# Altium schematic sheet I2C_Keypad.SchDoc
size B; DocumentNumber: 4; SheetNumber: 4; SheetTotal: 6
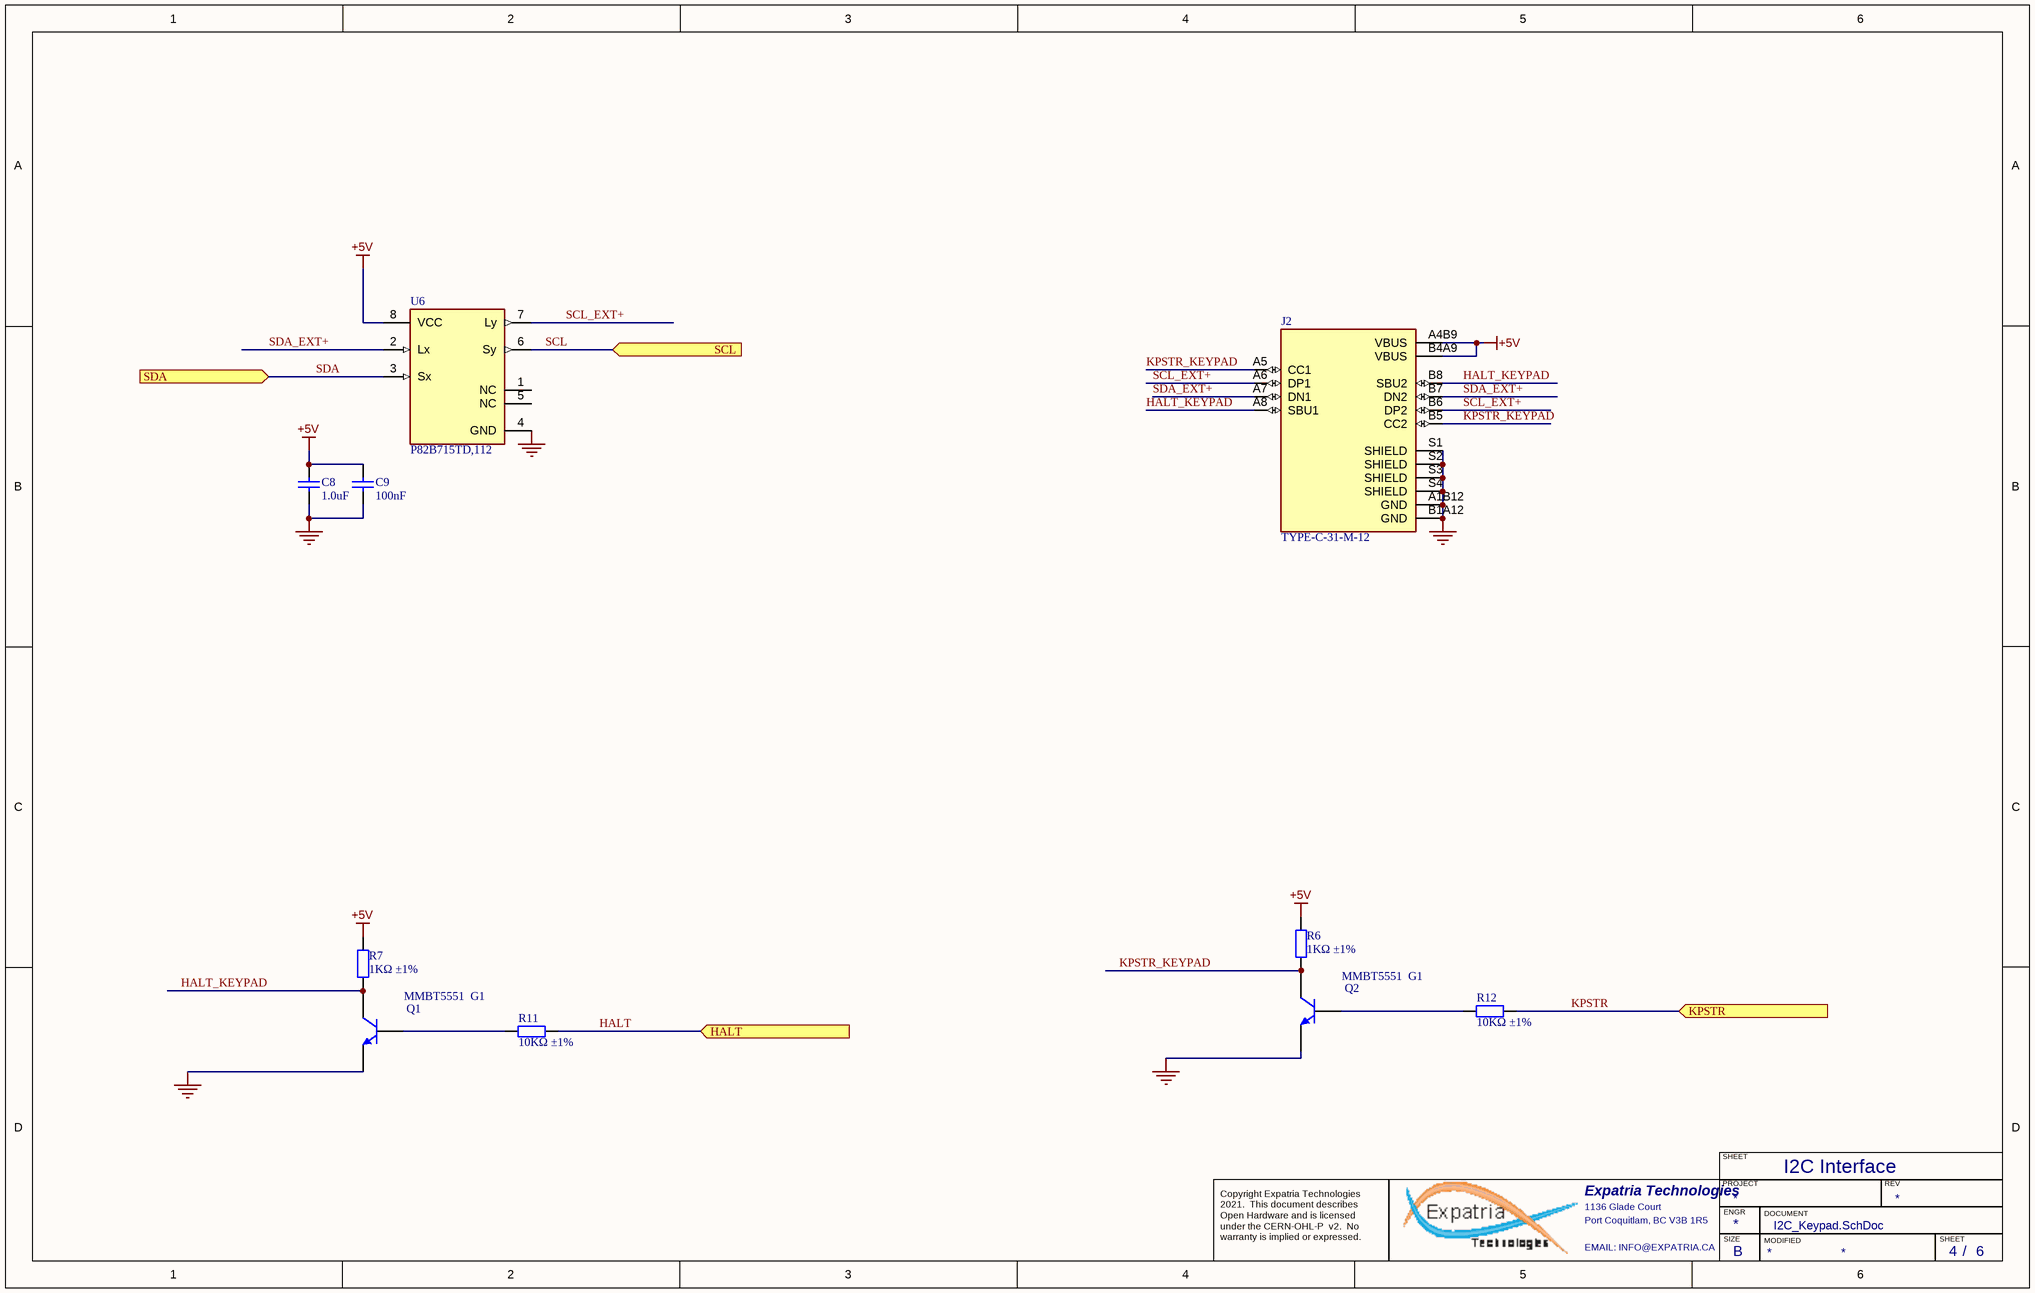
[diagram p0: I2C_Keypad.SchDoc]

## Parts
C8  1.0uF  [0402_C]
C9  100nF  [0402_C]
J2  TYPE-C-31-M-12  [HRO_TYPE-C-31-M-12]
Q1  MMBT5551  G1  [SOT-23(SOT-23-3)]
Q2  MMBT5551  G1  [SOT-23(SOT-23-3)]
R6  1KΩ ±1%  [0402_R]
R7  1KΩ ±1%  [0402_R]
R11  10KΩ ±1%  [0402_R]
R12  10KΩ ±1%  [0402_R]
U6  P82B715TD,112  [FP-SOT96-1-MFG]

## Ports
HALT (in), KPSTR (in), SCL (in), SDA (in)

## Nets
+5V: C8.2 C9.2 J2.A4B9(VBUS) J2.B4A9(VBUS) R6.1 R7.1 U6.8(VCC)
GND: C8.1 C9.1 J2.A1B12(GND) J2.B1A12(GND) J2.S1(SHIELD) J2.S2(SHIELD) J2.S3(SHIELD) J2.S4(SHIELD) Q1.2(E) Q2.2(E) U6.4(GND)
HALT: R11.2 ; port HALT
HALT_KEYPAD: J2.A8(SBU1) J2.B8(SBU2) Q1.3(C) R7.2
KPSTR: R12.1 ; port KPSTR
KPSTR_KEYPAD: J2.A5(CC1) J2.B5(CC2) Q2.3(C) R6.2
SCL: U6.6(Sy) ; port SCL
SCL_EXT+: J2.A6(DP1) J2.B6(DP2) U6.7(Ly)
SDA: U6.3(Sx) ; port SDA
SDA_EXT+: J2.A7(DN1) J2.B7(DN2) U6.2(Lx)
NetQ1_1: Q1.1(B) R11.1
NetQ2_1: Q2.1(B) R12.2

Not connected (* = marked no-connect by the designer): U6 1(NC) 5(NC)

## Notes on the sheet
- I2C Interface
- SHEET
- Expatria Technologies
- 1136 Glade Court
- Port Coquitlam, BC V3B 1R5
- PROJECT
- SIZE
- ENGR
- MODIFIED
- DOCUMENT
- REV
- Copyright Expatria Technologies 2021.  This document describes Open Hardware and is licensed under the CERN-OHL-P  v2.  No warranty is implied or expressed.
- EMAIL: INFO@EXPATRIA.CA
- B
- /

## Library data of the parts
C8 = 0402 1.0uF (105) 10% 25V: Chip capacitor; Manufacturer: Samsung Electro-Mechanics; PartNumber: CL05A105KA5NQNC; Capacitance: 1uF; Tolerance: 10%; Voltage: 25V; ComponentLink1Description: Supplier link; ComponentLink1URL: http://www.szlcsc.com/product/details_53938.html; Package: 0402; Supplier: LC; SuppliersPartNumber: C52923
C9 = 0402 100nF (104) 10% 16V: Chip capacitors; Manufacturer: Samsung Electro-Mechanics; PartNumber: CL05B104KO5NNNC; Tolerance: 10%; Voltage: 16V; ComponentLink1Description: Supplier link; ComponentLink1URL: http://www.szlcsc.com/product/details_1877.html; Package: 0402; Supplier: LC; SuppliersPartNumber: C1525; Capacitance: 100nF
J2 = TYPE-C-31-M-12: USB Connectors 24 Receptacle 1 8.94*7.3mm RoHS; MF: HRO Electronics Co., Ltd.; Value: *; SnapEDA_Link: https://www.snapeda.com/parts/TYPE-C-31-M-12/HRO%20Electronics%20Co.,%20Ltd./view-part/3228496/?ref=snap; Package: Package; MP: TYPE-C-31-M-12; Price: None; Availability: Unavailable; SuppliersPartNumber: C2765186
Q1 Q2 = SOT-23 MMBT5551  G1: 三极管; ComponentLink1Description: 供应商链接; ComponentLink1URL: http://www.szlcsc.com/product/details_2502.html; Package: SOT-23; Supplier: LC; SuppliersPartNumber: C2145
R6 R7 = 0402 1K (1001) 1%: Chip resistor; Manufacturer: Uniroyal Elec; PartNumber: 0402WGF1001TCE; Power: 1/16W; ComponentLink1Description: Supplier link; ComponentLink1URL: http://www.szlcsc.com/product/details_12256.html; Package: 0402; Supplier: LC; SuppliersPartNumber: C11702; Resistance: 1KΩ; Tolerance: 1%
R11 R12 = 0402 10K (1002) 1%: Chip resistor; Manufacturer: Uniroyal Elec; PartNumber: 0402WGF1002TCE; Power: 1/16W; ComponentLink1Description: Supplier link; ComponentLink1URL: http://www.szlcsc.com/product/details_26487.html; Package: 0402; Supplier: LC; SuppliersPartNumber: C25744; Resistance: 10KΩ; Tolerance: 1%
U6 = CMP-10107-000005-1: IC REDRIVER I2C 1CH 400KHZ 8SO; Manufacturer: NXP Semicon; Manufacturer_Part_Number: P82B715TD,118; Package: SO-8; SuppliersPartNumber: C2649394